# EAGLE board axiom_beta_power_board_v0.20 (EAGLE 7.0.0), part 1 of 3
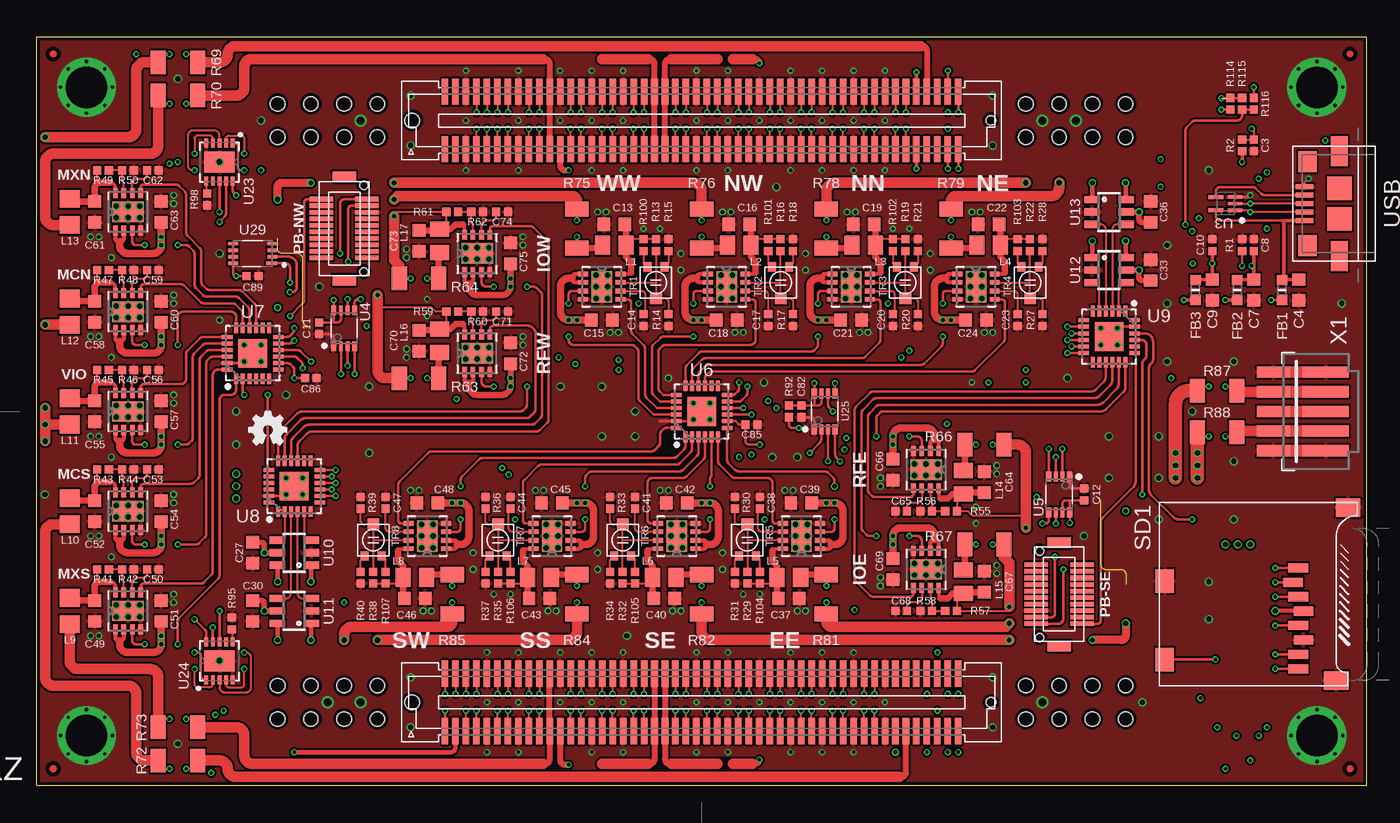
[diagram p10: board, top side]
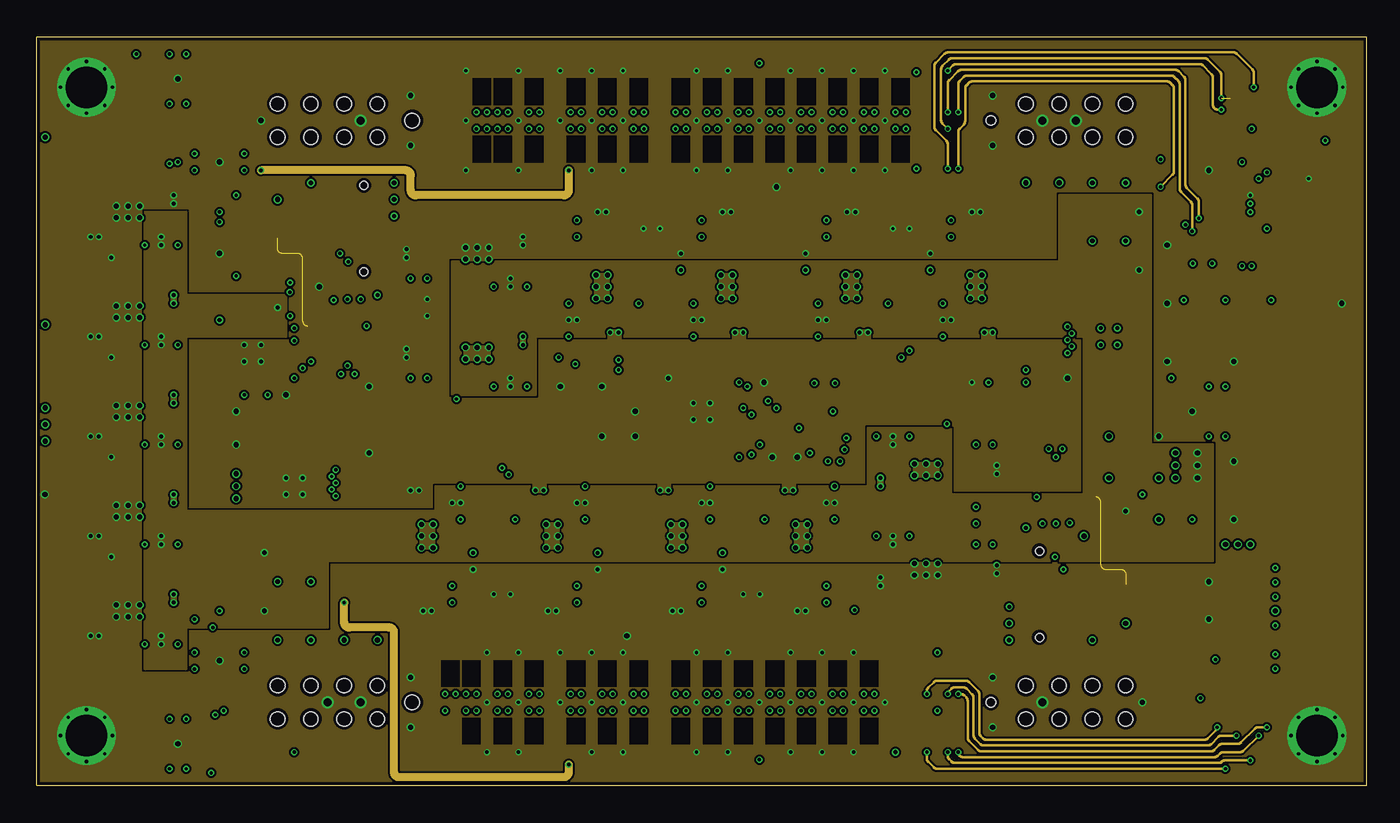
[diagram p11: board, inner layer Route2]
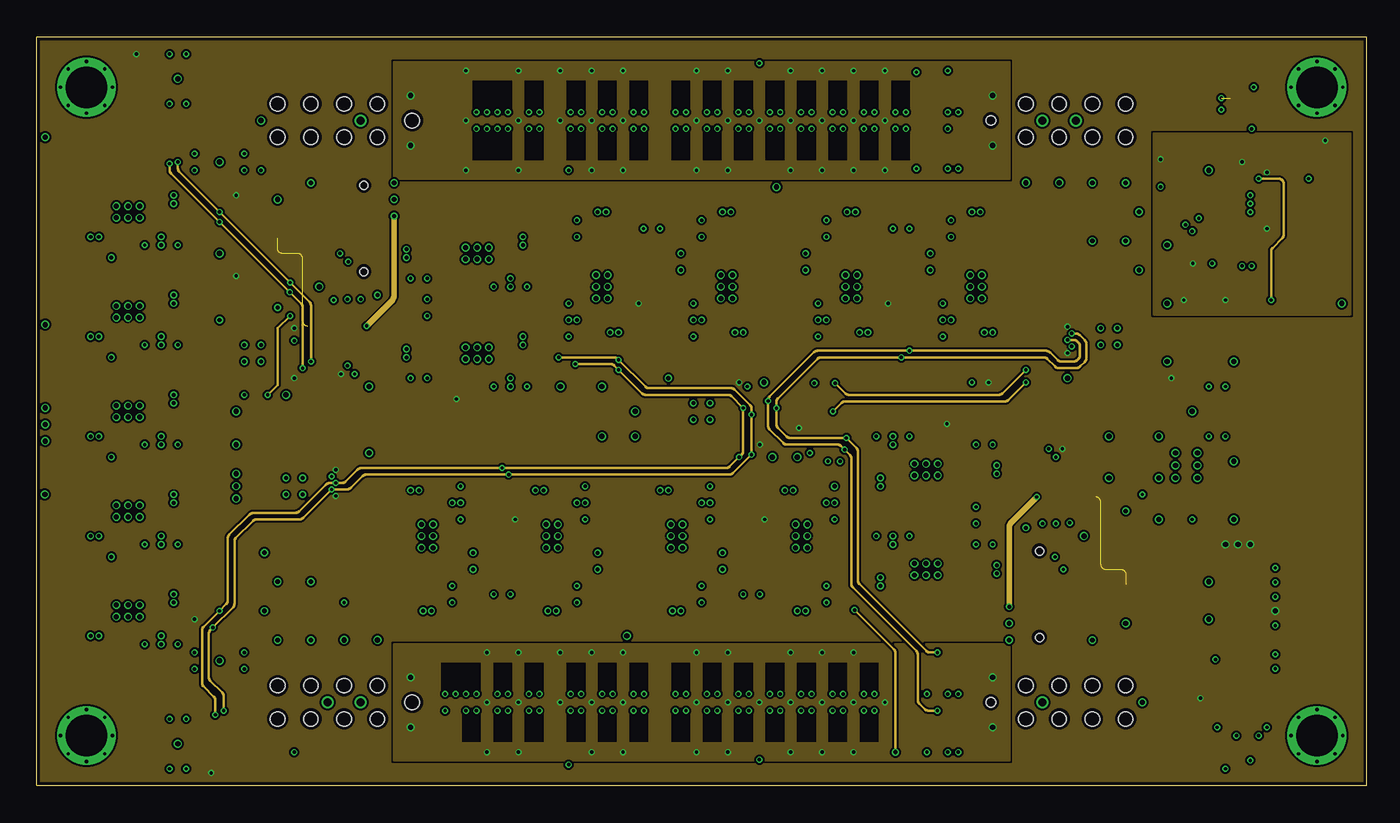
[diagram p12: board, inner layer Route15]
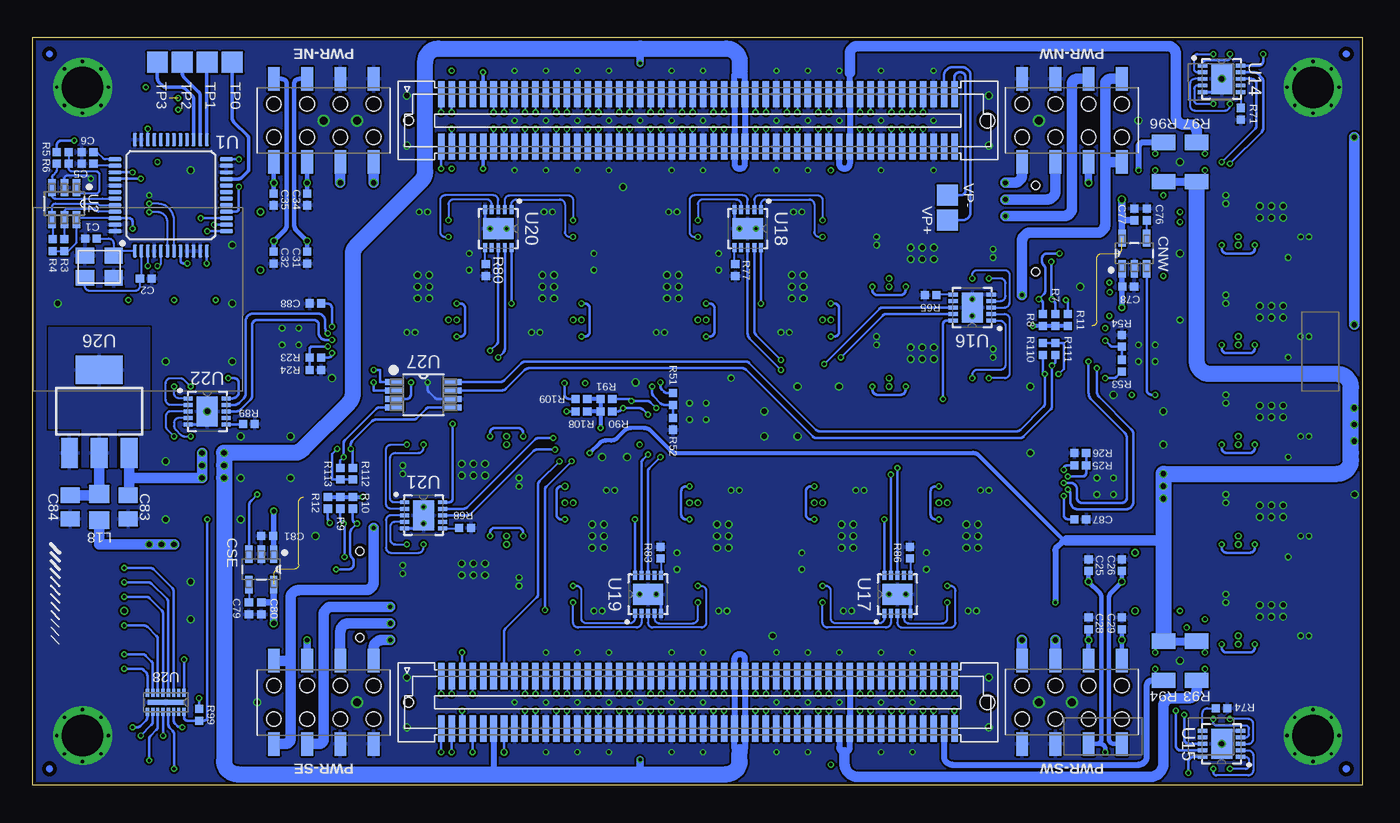
[diagram p13: board, bottom side, seen from below]

Size 101.6 x 57.15 mm. Coordinates in mm from the lower left corner, seen from the top.
Outline: 101.6,57.15 0,57.15 0,0 101.6,0 101.6,57.15
Copper layers (1*2*15*16): Top 0.035559375mm / dielectric 0.17018125mm / Route2 0.01778125mm / dielectric 47mil / Route15 0.01778125mm / dielectric 0.17018125mm / Bottom 0.035559375mm
Design rules "OSHPark-4layer-tuned *": minimum track width 5mil, minimum drill 10mil, track to track 6mil, track to pad 5mil, pad to pad 5mil, via to via 5mil, smd to smd 0mil, copper to edge 10mil, drill to drill 6mil, minimum pad ring 4mil, minimum via ring 4mil, stop-mask expansion 2mil, vias tented up to drill 25mil, thermal gap 6mil
Net classes: 1 LVDS: width 0.152 mm, drill 0.254 mm, clearance 0.152 mm
tKeepout: area 1.3,50.8 to 6.3,55.9; area 1.3,1.3 to 6.3,6.3; area 95.2,1.3 to 100.3,6.3; area 95.2,50.8 to 100.3,55.9
bKeepout: area 95.2,50.8 to 100.3,55.9; area 95.2,1.3 to 100.3,6.3; area 1.3,1.3 to 6.3,6.3; area 1.3,50.8 to 6.3,55.9
tRestrict: area 99.8,55.3 to 100.9,56.4; area 99.8,0.7 to 100.9,1.8; area 0.7,55.3 to 1.8,56.4; area 0.7,0.7 to 1.8,1.8
bRestrict: area 99.8,55.3 to 100.9,56.4; area 99.8,0.7 to 100.9,1.8; area 0.7,55.3 to 1.8,56.4; area 0.7,0.7 to 1.8,1.8

## Footprints (pad centres in the part's own frame; a part is rotated, then mirrored left to right if it is on the bottom)
µZ-SOCKET-NOHOLES-R = smd 0.5 x 2: 1 19.6,24.425; 2 19.6,20.027; 3 18.8,24.425; 4 18.8,20.027; 5 18,24.425; 6 18,20.027; 7 17.2,24.425; 8 17.2,20.027; 9 16.4,24.425; 10 16.4,20.027; 11 15.6,24.425; 12 15.6,20.027; 13 14.8,24.425; 14 14.8,20.027; 15 14,24.425; 16 14,20.027; 17 13.2,24.425; 18 13.2,20.027; 19 12.4,24.425; 20 12.4,20.027; 21 11.6,24.425; 22 11.6,20.027; 23 10.8,24.425; 24 10.8,20.027; 25 10,24.425; 26 10,20.027; 27 9.2,24.425; 28 9.2,20.027; 29 8.4,24.425; 30 8.4,20.027; 31 7.6,24.425; 32 7.6,20.027; 33 6.8,24.425; 34 6.8,20.027; 35 6,24.425; 36 6,20.027; 37 5.2,24.425; 38 5.2,20.027; 39 4.4,24.425; 40 4.4,20.027; 41 3.6,24.425; 42 3.6,20.027; 43 2.8,24.425; 44 2.8,20.027; 45 2,24.425; 46 2,20.027; 47 1.2,24.425; 48 1.2,20.027; 49 0.4,24.425; 50 0.4,20.027; 51 -0.4,24.425; 52 -0.4,20.027; 53 -1.2,24.425; 54 -1.2,20.027; 55 -2,24.425; 56 -2,20.027; 57 -2.8,24.425; 58 -2.8,20.027; 59 -3.6,24.425; 60 -3.6,20.027; 61 -4.4,24.425; 62 -4.4,20.027; 63 -5.2,24.425; 64 -5.2,20.027; 65 -6,24.425; 66 -6,20.027; 67 -6.8,24.425; 68 -6.8,20.027; 69 -7.6,24.425; 70 -7.6,20.027; 71 -8.4,24.425; 72 -8.4,20.027; 73 -9.2,24.425; 74 -9.2,20.027; 75 -10,24.425; 76 -10,20.027; 77 -10.8,24.425; 78 -10.8,20.027; 79 -11.6,24.425; 80 -11.6,20.027; 81 -12.4,24.425; 82 -12.4,20.027; 83 -13.2,24.425; 84 -13.2,20.027; 85 -14,24.425; 86 -14,20.027; 87 -14.8,24.425; 88 -14.8,20.027; 89 -15.6,24.425; 90 -15.6,20.027; 91 -16.4,24.425; 92 -16.4,20.027; 93 -17.2,24.425; 94 -17.2,20.027; 95 -18,24.425; 96 -18,20.027; 97 -18.8,24.425; 98 -18.8,20.027; 99 -19.6,24.425; 100 -19.6,20.027; 101 19.6,-20.025; 102 19.6,-24.425; 103 18.8,-20.027; 104 18.8,-24.425; 105 18,-20.027; 106 18,-24.425; 107 17.2,-20.027; 108 17.2,-24.425; 109 16.4,-20.027; 110 16.4,-24.425; 111 15.6,-20.027; 112 15.6,-24.425; 113 14.8,-20.027; 114 14.8,-24.425; 115 14,-20.027; 116 14,-24.425; 117 13.2,-20.027; 118 13.2,-24.425; 119 12.4,-20.027; 120 12.4,-24.425; 121 11.6,-20.027; 122 11.6,-24.425; 123 10.8,-20.027; 124 10.8,-24.425; 125 10,-20.027; 126 10,-24.425; 127 9.2,-20.027; 128 9.2,-24.425; 129 8.4,-20.027; 130 8.4,-24.425; 131 7.6,-20.027; 132 7.6,-24.425; 133 6.8,-20.027; 134 6.8,-24.425; 135 6,-20.027; 136 6,-24.425; 137 5.2,-20.027; 138 5.2,-24.425; 139 4.4,-20.027; 140 4.4,-24.425; 141 3.6,-20.027; 142 3.6,-24.425; 143 2.8,-20.027; 144 2.8,-24.425; 145 2,-20.027; 146 2,-24.425; 147 1.2,-20.027; 148 1.2,-24.425; 149 0.4,-20.027; 150 0.4,-24.425; 151 -0.4,-20.027; 152 -0.4,-24.425; 153 -1.2,-20.027; 154 -1.2,-24.425; 155 -2,-20.027; 156 -2,-24.425; 157 -2.8,-20.027; 158 -2.8,-24.425; 159 -3.6,-20.027; 160 -3.6,-24.425; 161 -4.4,-20.027; 162 -4.4,-24.425; 163 -5.2,-20.027; 164 -5.2,-24.425; 165 -6,-20.027; 166 -6,-24.425; 167 -6.8,-20.027; 168 -6.8,-24.425; 169 -7.6,-20.027; 170 -7.6,-24.425; 171 -8.4,-20.027; 172 -8.4,-24.425; 173 -9.2,-20.027; 174 -9.2,-24.425; 175 -10,-20.027; 176 -10,-24.425; 177 -10.8,-20.027; 178 -10.8,-24.425; 179 -11.6,-20.027; 180 -11.6,-24.425; 181 -12.4,-20.027; 182 -12.4,-24.425; 183 -13.2,-20.027; 184 -13.2,-24.425; 185 -14,-20.027; 186 -14,-24.425; 187 -14.8,-20.027; 188 -14.8,-24.425; 189 -15.6,-20.027; 190 -15.6,-24.425; 191 -16.4,-20.027; 192 -16.4,-24.425; 193 -17.2,-20.027; 194 -17.2,-24.425; 195 -18,-20.027; 196 -18,-24.425; 197 -18.8,-20.027; 198 -18.8,-24.425; 199 -19.6,-20.027; 200 -19.6,-24.425 | hole 0.725: 22.1,22.225; 22.1,-22.225 | hole 1.125: -22.1,22.225; -22.1,-22.225
0402-B = smd 0.62 x 0.62: 1 -0.45,0; 2 0.45,0
0603-B = smd 0.95 x 1: 1 -0.8,0; 2 0.8,0
0805-B = smd 1.15 x 1.45: 1 -0.9,0; 2 0.9,0
SOT95P280X145-5N = smd 1.321 x 0.559: 1 -1.168,0.94; 2 -1.168,0; 3 -1.168,-0.94; 4 1.168,-0.94; 5 1.168,0.94
DFN65P300X300X100-9N = smd 0.762 x 0.356: 1 -1.422,0.965; 2 -1.422,0.33; 3 -1.422,-0.33; 4 -1.422,-0.965; 5 1.422,-0.965; 6 1.422,-0.33; 7 1.422,0.33; 8 1.422,0.965 | smd 1.549 x 2.413: 9 0,0
_0603MP = smd 0.8 x 0.8: 1 -0.762,0; 2 0.762,0
0805-A = smd 1.35 x 1.55: 1 -1,0; 2 1,0
DF12(XX)-20DP-0.5V = smd 1.8 x 0.35: 1 -1.75,2.25; 2 1.75,2.25; 3 -1.75,1.75; 4 1.75,1.75; 5 -1.75,1.25; 6 1.75,1.25; 7 -1.75,0.75; 8 1.75,0.75; 9 -1.75,0.25; 10 1.75,0.25; 11 -1.75,-0.25; 12 1.75,-0.25; 13 -1.75,-0.75; 14 1.75,-0.75; 15 -1.75,-1.25; 16 1.75,-1.25; 17 -1.75,-1.75; 18 1.75,-1.75; 19 -1.75,-2.25; 20 1.75,-2.25 | smd 1.8 x 0.8: M1 0,3.95; M2 0,-3.95 | hole 0.625: 1.5,-3.3; 1.5,3.3
R2X04 = smd 0.9 x 1.8: 1 -3.81,3.175; 2 -3.81,-3.175; 3 -1.27,3.175; 4 -1.27,-3.175; 5 1.27,3.175; 6 1.27,-3.175; 7 3.81,3.175; 8 3.81,-3.175 | hole 1.1: -3.81,1.27; -1.27,1.27; -1.27,-1.27; -3.81,-1.27; 1.27,1.27; 1.27,-1.27; 3.81,1.27; 3.81,-1.27
ABM8G = smd 1.4 x 1.2: 1 -1.1,-0.85; 2 1.1,-0.85; 3 1.1,0.85; 4 -1.1,0.85
1206-B = smd 1.15 x 1.8: 1 -1.5,0; 2 1.5,0
TF-MICRO-SD_PP2 = smd 0.7 x 1.5: 1 9,-10.64; 2 7.9,-10.24; 3 6.8,-10.64; 4 5.7,-11.04; 5 4.6,-10.64; 6 3.5,-11.04; 7 2.4,-10.64; 8 1.3,-10.64 | smd 1.8 x 1.4: CD1 2,-0.44; CD2 8,-0.44 | smd 1.4 x 1.9: MT1 0.4,-13.54; MT2 13.6,-14.44
TP16SQ = smd 1.6 x 1.6: TP 0,0
TRIM-PVZ2A = smd 0.6 x 0.7: 1 -0.65,-1.2; 3 0.65,-1.2 | smd 0.9 x 0.9: 2 0,1.2
LQFP48 = smd 0.3 x 1: 1 -2.75,-4.25; 2 -2.25,-4.25; 3 -1.75,-4.25; 4 -1.25,-4.25; 5 -0.75,-4.25; 6 -0.25,-4.25; 7 0.25,-4.25; 8 0.75,-4.25; 9 1.25,-4.25; 10 1.75,-4.25; 11 2.25,-4.25; 12 2.75,-4.25; 25 2.75,4.25; 26 2.25,4.25; 27 1.75,4.25; 28 1.25,4.25; 29 0.75,4.25; 30 0.25,4.25; 31 -0.25,4.25; 32 -0.75,4.25; 33 -1.25,4.25; 34 -1.75,4.25; 35 -2.25,4.25; 36 -2.75,4.25 | smd 1 x 0.3: 13 4.25,-2.75; 14 4.25,-2.25; 15 4.25,-1.75; 16 4.25,-1.25; 17 4.25,-0.75; 18 4.25,-0.25; 19 4.25,0.25; 20 4.25,0.75; 21 4.25,1.25; 22 4.25,1.75; 23 4.25,2.25; 24 4.25,2.75; 37 -4.25,2.75; 38 -4.25,2.25; 39 -4.25,1.75; 40 -4.25,1.25; 41 -4.25,0.75; 42 -4.25,0.25; 43 -4.25,-0.25; 44 -4.25,-0.75; 45 -4.25,-1.25; 46 -4.25,-1.75; 47 -4.25,-2.25; 48 -4.25,-2.75
SOT95P280X145-6N = smd 1.27 x 0.559: 1 -1.219,0.94; 2 -1.219,0; 3 -1.219,-0.94; 4 1.219,-0.94; 5 1.219,0; 6 1.219,0.94
SOT50P160X60-5N = smd 1.118 x 0.254: 1 -0.737,0.508; 2 -0.737,0; 3 -0.737,-0.508 | smd 1.118 x 0.305: 4 0.737,-0.508; 5 0.737,0.508
VSSOP-8 = smd 0.75 x 0.4: 1 -1.375,0.8; 4 -1.375,-0.8; 5 1.375,-0.8; 8 1.375,0.8 | smd 0.75 x 0.3: 2 -1.375,0.25; 3 -1.375,-0.25; 6 1.375,-0.25; 7 1.375,0.25
QFN50P400X400X80-25N = smd 0.813 x 0.305: 1 -1.95,1.25; 2 -1.95,0.75; 3 -1.95,0.25; 4 -1.95,-0.25; 5 -1.95,-0.75; 6 -1.95,-1.25; 13 1.95,-1.25; 14 1.95,-0.75; 15 1.95,-0.25; 16 1.95,0.25; 17 1.95,0.75; 18 1.95,1.25 | smd 0.305 x 0.813: 7 -1.25,-1.95; 8 -0.75,-1.95; 9 -0.25,-1.95; 10 0.25,-1.95; 11 0.75,-1.95; 12 1.25,-1.95; 19 1.25,1.95; 20 0.75,1.95; 21 0.25,1.95; 22 -0.25,1.95; 23 -0.75,1.95; 24 -1.25,1.95 | smd 2.2 x 2.2: 25 0,0
SOT23-6 = smd 0.55 x 1.2: 1 -0.95,-1.3; 2 0,-1.3; 3 0.95,-1.3; 4 0.95,1.3; 5 0,1.3; 6 -0.95,1.3
DFN3X3_10LEAD = smd 0.7 x 0.3: 1 -1.45,1; 2 -1.45,0.5; 3 -1.45,0; 4 -1.45,-0.5; 5 -1.45,-1; 6 1.45,-1; 7 1.45,-0.5; 8 1.45,0; 9 1.45,0.5; 10 1.45,1 | smd 1.6 x 2.3: EPAD 0,0
SOT-223 = smd 1.27 x 2.286: 1 -2.286,-3.175; 2 0,-3.175; 3 2.286,-3.175 | smd 3.556 x 2.159: TER 0,3.175
SOP65P490X110-8N = smd 1.422 x 0.457: 1 -2.21,0.965; 2 -2.21,0.33; 3 -2.21,-0.33; 4 -2.21,-0.965; 5 2.21,-0.965; 6 2.21,-0.33; 7 2.21,0.33; 8 2.21,0.965
SON40P135X330X55-17N = smd 0.61 x 0.254: 1 -0.737,1.397; 2 -0.737,0.991; 3 -0.737,0.61; 4 -0.737,0.203; 5 -0.737,-0.203; 6 -0.737,-0.61; 7 -0.737,-0.991; 8 -0.737,-1.397; 9 0.737,-1.397; 10 0.737,-0.991; 11 0.737,-0.61; 12 0.737,-0.203; 13 0.737,0.203; 14 0.737,0.61; 15 0.737,0.991; 16 0.737,1.397 | smd 0.406 x 2.794: 17 0,0
SOT996-2/3 = smd 0.25 x 0.85: 1 -0.75,-1.45 | smd 0.25 x 0.75: 2 -0.25,-1.5; 3 0.25,-1.5; 4 0.75,-1.5; 5 0.75,1.5; 6 0.25,1.5; 7 -0.25,1.5; 8 -0.75,1.5
MICRO-AB-H-SMT = smd 0.4 x 1.35: 1 -1.3,4.125; 2 -0.65,4.125; 3 0,4.125; 4 0.65,4.125; 5 1.3,4.125 | smd 2.3 x 1.3: Z1 -4,1.45; Z4 4,1.45 | smd 1.8 x 1.9: Z2 -1.15,1.45; Z3 1.15,1.45 | smd 1.6 x 1.4: Z5 -3.2,3.9; Z6 3.2,3.9
PICO-SPOX-5 = smd 0.85 x 2.55: 1 -3,-6.5; 2 -1.5,-6.5; 3 0,-6.5; 4 1.5,-6.5; 5 3,-6.5 | smd 0.85 x 3.55: 1A -3,-2.5; 2A -1.5,-2.5; 3A 0,-2.5; 4A 1.5,-2.5; 5A 3,-2.5
µZ-CONONLY = smd 0.5 x 2: 1 19.6,-24.226; 2 19.6,-20.226; 3 18.8,-24.226; 4 18.8,-20.226; 5 18,-24.226; 6 18,-20.226; 7 17.2,-24.226; 8 17.2,-20.226; 9 16.4,-24.226; 10 16.4,-20.226; 11 15.6,-24.226; 12 15.6,-20.226; 13 14.8,-24.226; 14 14.8,-20.226; 15 14,-24.226; 16 14,-20.226; 17 13.2,-24.226; 18 13.2,-20.226; 19 12.4,-24.226; 20 12.4,-20.226; 21 11.6,-24.226; 22 11.6,-20.226; 23 10.8,-24.226; 24 10.8,-20.226; 25 10,-24.226; 26 10,-20.226; 27 9.2,-24.226; 28 9.2,-20.226; 29 8.4,-24.226; 30 8.4,-20.226; 31 7.6,-24.226; 32 7.6,-20.226; 33 6.8,-24.226; 34 6.8,-20.226; 35 6,-24.226; 36 6,-20.226; 37 5.2,-24.226; 38 5.2,-20.226; 39 4.4,-24.226; 40 4.4,-20.226; 41 3.6,-24.226; 42 3.6,-20.226; 43 2.8,-24.226; 44 2.8,-20.226; 45 2,-24.226; 46 2,-20.226; 47 1.2,-24.226; 48 1.2,-20.226; 49 0.4,-24.226; 50 0.4,-20.226; 51 -0.4,-24.226; 52 -0.4,-20.226; 53 -1.2,-24.226; 54 -1.2,-20.226; 55 -2,-24.226; 56 -2,-20.226; 57 -2.8,-24.226; 58 -2.8,-20.226; 59 -3.6,-24.226; 60 -3.6,-20.226; 61 -4.4,-24.226; 62 -4.4,-20.226; 63 -5.2,-24.226; 64 -5.2,-20.226; 65 -6,-24.226; 66 -6,-20.226; 67 -6.8,-24.226; 68 -6.8,-20.226; 69 -7.6,-24.226; 70 -7.6,-20.226; 71 -8.4,-24.226; 72 -8.4,-20.226; 73 -9.2,-24.226; 74 -9.2,-20.226; 75 -10,-24.226; 76 -10,-20.226; 77 -10.8,-24.226; 78 -10.8,-20.226; 79 -11.6,-24.226; 80 -11.6,-20.226; 81 -12.4,-24.226; 82 -12.4,-20.226; 83 -13.2,-24.226; 84 -13.2,-20.226; 85 -14,-24.226; 86 -14,-20.226; 87 -14.8,-24.226; 88 -14.8,-20.226; 89 -15.6,-24.226; 90 -15.6,-20.226; 91 -16.4,-24.226; 92 -16.4,-20.226; 93 -17.2,-24.226; 94 -17.2,-20.226; 95 -18,-24.226; 96 -18,-20.226; 97 -18.8,-24.226; 98 -18.8,-20.226; 99 -19.6,-24.226; 100 -19.6,-20.226; 101 19.6,20.226; 102 19.6,24.226; 103 18.8,20.226; 104 18.8,24.226; 105 18,20.226; 106 18,24.226; 107 17.2,20.226; 108 17.2,24.226; 109 16.4,20.226; 110 16.4,24.226; 111 15.6,20.226; 112 15.6,24.226; 113 14.8,20.226; 114 14.8,24.226; 115 14,20.226; 116 14,24.226; 117 13.2,20.226; 118 13.2,24.226; 119 12.4,20.226; 120 12.4,24.226; 121 11.6,20.226; 122 11.6,24.226; 123 10.8,20.226; 124 10.8,24.226; 125 10,20.226; 126 10,24.226; 127 9.2,20.226; 128 9.2,24.226; 129 8.4,20.226; 130 8.4,24.226; 131 7.6,20.226; 132 7.6,24.226; 133 6.8,20.226; 134 6.8,24.226; 135 6,20.226; 136 6,24.226; 137 5.2,20.226; 138 5.2,24.226; 139 4.4,20.226; 140 4.4,24.226; 141 3.6,20.226; 142 3.6,24.226; 143 2.8,20.226; 144 2.8,24.226; 145 2,20.226; 146 2,24.226; 147 1.2,20.226; 148 1.2,24.226; 149 0.4,20.226; 150 0.4,24.226; 151 -0.4,20.226; 152 -0.4,24.226; 153 -1.2,20.226; 154 -1.2,24.226; 155 -2,20.226; 156 -2,24.226; 157 -2.8,20.226; 158 -2.8,24.226; 159 -3.6,20.226; 160 -3.6,24.226; 161 -4.4,20.226; 162 -4.4,24.226; 163 -5.2,20.226; 164 -5.2,24.226; 165 -6,20.226; 166 -6,24.226; 167 -6.8,20.226; 168 -6.8,24.226; 169 -7.6,20.226; 170 -7.6,24.226; 171 -8.4,20.226; 172 -8.4,24.226; 173 -9.2,20.226; 174 -9.2,24.226; 175 -10,20.226; 176 -10,24.226; 177 -10.8,20.226; 178 -10.8,24.226; 179 -11.6,20.226; 180 -11.6,24.226; 181 -12.4,20.226; 182 -12.4,24.226; 183 -13.2,20.226; 184 -13.2,24.226; 185 -14,20.226; 186 -14,24.226; 187 -14.8,20.226; 188 -14.8,24.226; 189 -15.6,20.226; 190 -15.6,24.226; 191 -16.4,20.226; 192 -16.4,24.226; 193 -17.2,20.226; 194 -17.2,24.226; 195 -18,20.226; 196 -18,24.226; 197 -18.8,20.226; 198 -18.8,24.226; 199 -19.6,20.226; 200 -19.6,24.226 | hole 1.125: -22.1,-22.225; -22.1,22.225 | hole 0.725: 22.1,-22.225; 22.1,22.225

## Placement (x,y rotation side)
BETA  µZ-FCI-SOCKET-NOHOLES-R  [µZ-SOCKET-NOHOLES-R]  50.8,28.57 0 top
C1  [0402-B]  97.16,41.78 180 bottom
C2  [0402-B]  92.96,38.73 0 bottom
C3  10n  [0402-B]  92.96,48.89 270 top
C4  100n  [0603-B]  96.39,37.85 270 top
C5  100n  [0402-B]  97.41,47.5 180 bottom
C6  100n  [0402-B]  97.41,48.39 180 bottom
C7  4µ7  [0603-B]  92.96,37.85 270 top
C8  100n  [0402-B]  92.96,41.27 90 top
C9  4µ7  [0603-B]  89.79,37.85 270 top
C10  100n  [0402-B]  89.79,41.27 90 top
C11  10n  [0402-B]  21.59,34.92 270 top
C12  10n  [0402-B]  80.01,22.23 90 top
C13  [0603-B]  44.13,42.86 180 top
C14  [0402-B]  46.35,35.56 270 top
C15  [0603-B]  43.18,35.56 0 top
C16  [0603-B]  53.66,42.86 180 top
C17  [0402-B]  55.88,35.56 270 top
C18  [0603-B]  52.7,35.56 0 top
C19  [0603-B]  63.18,42.86 180 top
C20  [0402-B]  65.41,35.56 270 top
C21  [0603-B]  62.23,35.56 0 top
C22  [0603-B]  72.71,42.86 180 top
C23  [0402-B]  74.93,35.56 270 top
C24  [0603-B]  71.75,35.56 0 top
C25  1µ  [0402-B]  20.95,16.83 90 bottom
C26  1µ  [0402-B]  18.41,16.83 90 bottom
C27  4µ7  [0603-B]  16.51,17.78 270 top
C28  1µ  [0402-B]  20.95,12.38 90 bottom
C29  1µ  [0402-B]  18.41,12.38 90 bottom
C30  4µ7  [0603-B]  16.51,13.33 270 top
C31  1µ  [0402-B]  80.64,40.32 270 bottom
C32  1µ  [0402-B]  83.19,40.32 270 bottom
C33  4µ7  [0603-B]  85.09,39.37 90 top
C34  1µ  [0402-B]  80.64,44.77 270 bottom
C35  1µ  [0402-B]  83.19,44.77 270 bottom
C36  4µ7  [0603-B]  85.09,43.81 90 top
C37  [0603-B]  57.47,14.29 0 top
C38  [0402-B]  55.24,21.59 90 top
C39  [0603-B]  58.42,21.59 180 top
C40  [0603-B]  47.94,14.29 0 top
C41  [0402-B]  45.72,21.59 90 top
C42  [0603-B]  48.89,21.59 180 top
C43  [0603-B]  38.42,14.29 0 top
C44  [0402-B]  36.19,21.59 90 top
C45  [0603-B]  39.37,21.59 180 top
C46  [0603-B]  28.89,14.29 0 top
C47  [0402-B]  26.67,21.59 90 top
C48  [0603-B]  29.84,21.59 180 top
C49  [0603-B]  4.45,13.33 270 top
C50  [0402-B]  8.89,16.51 0 top
C51  [0603-B]  9.52,13.33 90 top
C52  [0603-B]  4.45,20.95 270 top
C53  [0402-B]  8.89,24.13 0 top
C54  [0603-B]  9.52,20.95 90 top
C55  [0603-B]  4.45,28.57 270 top
C56  [0402-B]  8.89,31.75 0 top
C57  [0603-B]  9.52,28.57 90 top
C58  [0603-B]  4.45,36.2 270 top
C59  [0402-B]  8.89,39.37 0 top
C60  [0603-B]  9.52,36.2 90 top
C61  [0603-B]  4.45,43.81 270 top
C62  [0402-B]  8.89,46.99 0 top
C63  [0603-B]  9.52,43.81 90 top
C64  [0603-B]  72.39,23.18 90 top
C65  [0402-B]  66.04,20.95 180 top
C66  [0603-B]  65.41,24.13 270 top
C67  [0603-B]  72.39,15.56 90 top
C68  [0402-B]  66.04,13.33 180 top
C69  [0603-B]  65.41,16.51 270 top
C70  10µ  [0603-B]  29.21,33.97 270 top
C71  [0402-B]  35.56,36.2 0 top
C72  10µ  [0603-B]  36.19,33.02 90 top
C73  [0603-B]  29.21,41.59 270 top
C74  [0402-B]  35.56,43.81 0 top
C75  [0603-B]  36.19,40.64 90 top
C76  10n  [0402-B]  16.51,43.62 90 bottom
C77  1µ  [0402-B]  17.46,43.62 90 bottom
C78  1µ  [0402-B]  17.93,38.1 0 bottom
C79  10n  [0402-B]  85.09,13.53 270 bottom
C80  1µ  [0402-B]  84.14,13.53 270 bottom
C81  1µ  [0402-B]  83.69,19.05 180 bottom
C82  10n  [0402-B]  58.42,28.57 270 top
C83  22µ  [0805-B]  94.3,21.27 270 bottom
C84  22µ  [0805-B]  98.74,21.27 270 bottom
C85  100n  [0402-B]  54.61,27.56 0 top
C86  100n  [0402-B]  20.95,31.11 0 top
C87  100n  [0402-B]  21.59,20.32 0 bottom
C88  100n  [0402-B]  80.01,36.83 180 bottom
C89  100n  [0402-B]  16.51,38.93 0 top
CNW  SPX3819M5-L  [SOT95P280X145-5N]  17.46,40.64 90 bottom
CSE  SPX3819M5-L  [SOT95P280X145-5N]  84.14,16.51 270 bottom
EE  MCP1727-ADJE/MF  [DFN65P300X300X100-9N]  58.42,19.05 180 top
FB1  600R  [_0603MP]  95.12,37.85 270 top
FB2  600R  [_0603MP]  91.69,37.85 90 top
FB3  600R  [_0603MP]  88.52,37.85 90 top
IOE  MCP1727-ADJE/MF  [DFN65P300X300X100-9N]  67.94,16.51 270 top
IOW  MCP1727-ADJE/MF  [DFN65P300X300X100-9N]  33.66,40.64 90 top
L1  [0805-B]  44.13,41.27 180 top
L2  [0805-B]  53.66,41.27 180 top
L3  [0805-B]  63.18,41.27 180 top
L4  [0805-B]  72.71,41.27 180 top
L5  [0805-B]  57.47,15.88 0 top
L6  [0805-B]  47.94,15.88 0 top
L7  [0805-B]  38.42,15.88 0 top
L8  [0805-B]  28.89,15.88 0 top
L9  [0805-A]  2.54,13.33 270 top
L10  [0805-A]  2.54,20.95 270 top
L11  [0805-A]  2.54,28.57 270 top
L12  [0805-A]  2.54,36.2 270 top
L13  [0805-A]  2.54,43.81 270 top
L14  [0805-B]  70.8,23.18 90 top
L15  [0805-B]  70.8,15.56 90 top
L16  [0805-B]  30.8,33.97 270 top
L17  [0805-B]  30.8,41.59 270 top
L18  [0805-A]  96.52,21.27 270 bottom
LOGO1  OSHW_LOGO_FILLX0100-NT  [OSHW_FILLX100_NOTEXT]  16.26,26.04 0 top
MCN  MCP1727-ADJE/MF  [DFN65P300X300X100-9N]  6.98,36.2 90 top
MCS  MCP1727-ADJE/MF  [DFN65P300X300X100-9N]  6.98,20.95 90 top
MXN  MCP1727-ADJE/MF  [DFN65P300X300X100-9N]  6.98,43.81 90 top
MXS  MCP1727-ADJE/MF  [DFN65P300X300X100-9N]  6.98,13.33 90 top
NE  MCP1727-ADJE/MF  [DFN65P300X300X100-9N]  71.75,38.1 0 top
NN  MCP1727-ADJE/MF  [DFN65P300X300X100-9N]  62.23,38.1 0 top
NW  MCP1727-ADJE/MF  [DFN65P300X300X100-9N]  52.7,38.1 0 top
PB-NW  DF12(XX)-20DP-0.5V  [DF12(XX)-20DP-0.5V]  23.49,42.55 0 top
PB-SE  DF12(XX)-20DP-0.5V  [DF12(XX)-20DP-0.5V]  78.1,14.6 180 top
PWR-NE  PINRC-2X04  [R2X04]  79.38,50.8 180 bottom
PWR-NW  PINRC-2X04  [R2X04]  22.22,50.8 0 bottom
PWR-SE  PINRC-2X04  [R2X04]  79.38,6.35 180 bottom
PWR-SW  PINRC-2X04  [R2X04]  22.22,6.35 0 bottom
Q1  SMD-4P-2G-3.2X2.5  [ABM8G]  96.52,39.62 180 bottom
R1  12k  [0402-B]  92.07,41.27 270 top
R2  10k  [0402-B]  92.07,48.89 270 top
R3  10k  [0402-B]  99.19,41.27 270 bottom
R4  10k  [0402-B]  100.08,41.27 270 bottom
R5  10k  [0402-B]  99.31,48.39 180 bottom
R6  2k  [0402-B]  99.31,47.5 180 bottom
R7  4k7  [0402-B]  23.49,35.56 90 bottom
R8  4k7  [0402-B]  24.45,35.56 90 bottom
R9  4k7  [0402-B]  78.1,21.59 270 bottom
R10  4k7  [0402-B]  77.15,21.59 270 bottom
R11  200k  [0402-B]  22.54,35.56 90 bottom
R12  200k  [0402-B]  79.06,21.59 270 bottom
R13  [0402-B]  47.31,41.27 270 top
R14  [0402-B]  48.26,35.56 270 top
R15  [0402-B]  48.26,41.27 90 top
R16  [0402-B]  56.83,41.27 270 top
R17  [0402-B]  57.78,35.56 270 top
R18  [0402-B]  57.78,41.27 90 top
R19  [0402-B]  66.36,41.27 270 top
R20  [0402-B]  67.31,35.56 270 top
R21  [0402-B]  67.31,41.27 90 top
R22  [0402-B]  75.88,41.27 270 top
R23  22k  [0402-B]  80.01,32.7 180 bottom
R24  10k  [0402-B]  80.01,31.75 0 bottom
R25  13k  [0402-B]  21.59,24.45 0 bottom
R26  10k  [0402-B]  21.59,25.4 180 bottom
R27  [0402-B]  76.83,35.56 270 top
R28  [0402-B]  76.83,41.27 90 top
R29  [0402-B]  54.29,15.88 90 top
R30  [0402-B]  53.34,21.59 90 top
R31  [0402-B]  53.34,15.88 270 top
R32  [0402-B]  44.77,15.88 90 top
R33  [0402-B]  43.81,21.59 90 top
R34  [0402-B]  43.81,15.88 270 top
R35  [0402-B]  35.24,15.88 90 top
R36  [0402-B]  34.29,21.59 90 top
R37  [0402-B]  34.29,15.88 270 top
R38  [0402-B]  25.72,15.88 90 top
R39  [0402-B]  24.76,21.59 90 top
R40  [0402-B]  24.76,15.88 270 top
R41  [0402-B]  5.08,16.51 0 top
R42  [0402-B]  6.98,16.51 0 top
R43  [0402-B]  5.08,24.13 0 top
R44  [0402-B]  6.98,24.13 0 top
R45  [0402-B]  5.08,31.75 0 top
R46  [0402-B]  6.98,31.75 0 top
R47  [0402-B]  5.08,39.37 0 top
R48  [0402-B]  6.98,39.37 0 top
R49  [0402-B]  5.08,46.99 0 top
R50  [0402-B]  6.98,46.99 0 top
R51  13k  [0402-B]  52.7,29.53 270 bottom
R52  3k  [0402-B]  52.7,27.62 270 bottom
R53  15k  [0402-B]  18.41,32.07 90 bottom
R54  1k  [0402-B]  18.41,33.97 90 bottom
R55  [0402-B]  69.85,20.95 180 top
R56  [0402-B]  67.94,20.95 180 top
R57  [0402-B]  69.85,13.33 180 top
R58  [0402-B]  67.94,13.33 180 top
R59  [0402-B]  31.75,36.2 0 top
R60  [0402-B]  33.66,36.2 0 top
R61  [0402-B]  31.75,43.81 0 top
R62  [0402-B]  33.66,43.81 0 top
R63  [1206-B]  29.21,31.11 180 top
R64  [1206-B]  29.21,38.73 180 top
R65  5k6  [0402-B]  33.02,37.47 180 bottom
R66  [1206-B]  72.39,26.04 0 top
R67  [1206-B]  72.39,18.41 0 top
R68  9k1  [0402-B]  68.58,19.68 0 bottom
R69  [1206-B]  10.79,55.25 0 top
R70  [1206-B]  10.79,52.7 0 top
R71  2k0  [0402-B]  9.33,51.31 270 bottom
R72  [1206-B]  10.79,1.9 0 top
R73  [1206-B]  10.79,4.45 0 top
R74  2k7  [0402-B]  10.79,5.91 0 bottom
R75  [1206-B]  41.27,42.55 90 top
R76  [1206-B]  50.8,42.55 90 top
R77  750R  [0402-B]  47.94,39.37 270 bottom
R78  [1206-B]  60.32,42.55 90 top
R79  [1206-B]  69.85,42.55 90 top
R80  1k27  [0402-B]  66.99,39.37 270 bottom
R81  [1206-B]  60.32,14.6 270 top
R82  [1206-B]  50.8,14.6 270 top
R83  0R  [0402-B]  53.66,17.78 90 bottom
R84  [1206-B]  41.27,14.6 270 top
R85  [1206-B]  31.75,14.6 270 top
R86  100R  [0402-B]  34.61,17.78 90 bottom
R87  [1206-B]  90.17,30.16 180 top
R88  [1206-B]  90.17,26.99 180 top
R89  1k6  [0402-B]  85.09,27.62 0 bottom
R90  4k7  [0402-B]  57.78,28.57 0 bottom
R91  4k7  [0402-B]  57.78,29.53 0 bottom
R92  200k  [0402-B]  57.47,28.57 90 top
R93  [1206-B]  12.7,9.52 270 bottom
R94  [1206-B]  15.24,9.52 270 bottom
R95  430R  [0402-B]  14.92,12.38 90 top
R96  [1206-B]  15.24,47.62 90 bottom
R97  [1206-B]  12.7,47.62 90 bottom
R98  560R  [0402-B]  13.02,44.77 270 top
R99  10k  [0402-B]  88.9,5.4 270 bottom
R100  [0402-B]  46.35,41.27 90 top
R101  [0402-B]  55.88,41.27 90 top
R102  [0402-B]  65.41,41.27 90 top
R103  [0402-B]  74.93,41.27 90 top
R104  [0402-B]  55.24,15.88 270 top
R105  [0402-B]  45.72,15.88 270 top
R106  [0402-B]  36.19,15.88 270 top
R107  [0402-B]  26.67,15.88 270 top
R108  4k7  [0402-B]  59.69,28.57 180 bottom
R109  4k7  [0402-B]  59.69,29.53 180 bottom
R110  4k7  [0402-B]  24.45,33.34 270 bottom
R111  4k7  [0402-B]  23.49,33.34 270 bottom
R112  4k7  [0402-B]  77.15,23.81 90 bottom
R113  4k7  [0402-B]  78.1,23.81 90 bottom
R114  0R  [0402-B]  91.19,52.07 90 top
R115  0R  [0402-B]  92.07,52.07 90 top
R116  0R  [0402-B]  92.96,52.07 90 top
RFE  MCP1727-ADJE/MF  [DFN65P300X300X100-9N]  67.94,24.13 270 top
RFW  MCP1727-ADJE/MF  [DFN65P300X300X100-9N]  33.66,33.02 90 top
SD1  MICRO-SD-2CD  [TF-MICRO-SD_PP2]  85.72,7.62 90 top
SE  MCP1727-ADJE/MF  [DFN65P300X300X100-9N]  48.89,19.05 180 top
SS  MCP1727-ADJE/MF  [DFN65P300X300X100-9N]  39.37,19.05 180 top
SW  MCP1727-ADJE/MF  [DFN65P300X300X100-9N]  29.84,19.05 180 top
TP0  TPTP16SQ  [TP16SQ]  86.36,55.25 0 bottom
TP1  TPTP16SQ  [TP16SQ]  88.27,55.25 180 bottom
TP2  TPTP16SQ  [TP16SQ]  90.17,55.25 0 bottom
TP3  TPTP16SQ  [TP16SQ]  92.07,55.25 0 bottom
TR1  PVZ2A  [TRIM-PVZ2A]  47.31,38.42 180 top
TR2  PVZ2A  [TRIM-PVZ2A]  56.83,38.42 180 top
TR3  PVZ2A  [TRIM-PVZ2A]  66.36,38.42 180 top
TR4  PVZ2A  [TRIM-PVZ2A]  75.88,38.42 180 top
TR5  PVZ2A  [TRIM-PVZ2A]  54.29,18.73 0 top
TR6  PVZ2A  [TRIM-PVZ2A]  44.77,18.73 0 top
TR7  PVZ2A  [TRIM-PVZ2A]  35.24,18.73 0 top
TR8  PVZ2A  [TRIM-PVZ2A]  25.72,18.73 0 top
U1  FT232H  [LQFP48]  91.06,45.09 0 bottom
U2  93LC46BT-I/OT  [SOT95P280X145-6N]  99.19,44.45 270 bottom
U3  TPD3E001DRLR  [SOT50P160X60-5N]  90.81,44.45 180 top
U4  GTL2002DC  [VSSOP-8]  23.49,34.92 90 top
U5  GTL2002DC  [VSSOP-8]  78.1,22.23 270 top
U6  [QFN50P400X400X80-25N]  50.8,28.57 90 top
U7  [QFN50P400X400X80-25N]  16.51,33.02 90 top
U8  [QFN50P400X400X80-25N]  19.68,22.86 90 top
U9  [QFN50P400X400X80-25N]  81.91,34.29 270 top
U10  [SOT23-6]  19.68,17.78 90 top
U11  [SOT23-6]  19.68,13.33 90 top
U12  [SOT23-6]  81.91,39.37 270 top
U13  [SOT23-6]  81.91,43.81 270 top
U14  PAC1720  [DFN3X3_10LEAD]  10.79,53.97 0 bottom
U15  PAC1720  [DFN3X3_10LEAD]  10.79,3.18 180 bottom
U16  PAC1720  [DFN3X3_10LEAD]  29.84,36.51 180 bottom
U17  PAC1720  [DFN3X3_10LEAD]  35.56,14.6 90 bottom
U18  PAC1720  [DFN3X3_10LEAD]  46.99,42.55 270 bottom
U19  PAC1720  [DFN3X3_10LEAD]  54.61,14.6 90 bottom
U20  PAC1720  [DFN3X3_10LEAD]  66.04,42.55 270 bottom
U21  PAC1720  [DFN3X3_10LEAD]  71.75,20.64 0 bottom
U22  PAC1720  [DFN3X3_10LEAD]  88.27,28.57 0 bottom
U23  PAC1720  [DFN3X3_10LEAD]  13.97,47.62 270 top
U24  PAC1720  [DFN3X3_10LEAD]  13.97,9.52 90 top
U25  GTL2002DC  [VSSOP-8]  60.2,28.57 90 top
U26  LD1117S  [SOT-223]  96.52,28.57 0 bottom
U27  PCA9540BDP  [SOP65P490X110-8N]  71.75,29.84 0 bottom
U28  IP4251CZ16-8-TTL  [SON40P135X330X55-17N]  91.44,6.35 270 bottom
U29  LM75BGD  [SOT996-2/3]  16.51,40.64 90 top
USB  5_USB_3S  [MICRO-AB-H-SMT]  100.97,44.45 90 top
VIO  MCP1727-ADJE/MF  [DFN65P300X300X100-9N]  6.98,28.57 90 top
VP+  TPTP16SQ  [TP16SQ]  31.75,43.18 180 bottom
VP-  TPTP16SQ  [TP16SQ]  31.75,45.09 180 bottom
WW  MCP1727-ADJE/MF  [DFN65P300X300X100-9N]  43.18,38.1 0 top
X1  PICO-SPOX-5  [PICO-SPOX-5]  100.97,28.57 270 top
ZED  µZ-FCI-CONONLY  [µZ-CONONLY]  50.8,28.57 180 bottom

## Tracks (layer width: path | path; a pad name or v marks a point on that pad's centre or on a via)
A_!SS  (via drill 0.25)
  Top 0.203: PB-NW.1 20.7,44.8 arc90 20.45,44.54 20.45,37.11 arc-45 20.33,36.84 v19.37,35.88 | v17.65,29.84 17.65,24.11 U8.19
  Route15 0.203: v19.37,35.88 18.41,34.92 18.41,30.61 v17.65,29.84
A_SCL  (via drill 0.25 pad 0.25)
  Top 0.203: PB-NW.2 23.56,44.8 arc90 23.18,44.41 v23.18,40.64 | v24.76,37.15 24.55,37.15 arc90 24.29,36.89 U4.5
  Bottom 0.203: R8.2 24.45,36.83 arc-90 v24.76,37.15 24.37,37.54 arc-45 24.26,37.81 24.26,39.47 arc-45 24.37,39.74 24.4,39.77 arc45 24.51,40.04 24.51,40.26 arc90 24.13,40.64 v23.18,40.64
A_SCL'  (via drill 0.25 pad 0.25)
  Top 0.203: v24.29,31.43 U4.4
  Bottom 0.203: U27.8 65.92,30.81 arc-45 65.56,30.96 64.28,32.24 arc45 63.92,32.38 47.15,32.38 arc45 46.88,32.27 41.77,27.16 arc-45 41.5,27.05 26.45,27.05 arc-45 26.18,27.16 24.41,28.93 arc-45 24.29,29.2 v24.29,31.43 24.45,31.59 R110.2
A_SDA  (via drill 0.25, 0.25 pad 0.25)
  Top 0.203: PB-NW.4 24.07,44.3 arc90 23.81,44.04 v23.81,40 | v23.74,37.15 U4.6
  Bottom 0.203: 23.49,36.13 R7.2 23.49,36.74 arc-45 23.61,37.01 v23.74,37.15 arc45 23.81,37.31 v23.81,40
A_SDA'  (via drill 0.25 pad 0.25)
  Top 0.203: v23.74,32.07 U4.3
  Bottom 0.203: U27.7 65.79,30.18 arc-45 65.43,30.32 64.03,31.73 arc45 63.67,31.88 47.4,31.88 arc45 47.13,31.77 42.02,26.66 arc-45 41.75,26.54 26.19,26.54 arc-45 25.92,26.66 23.86,28.72 arc-45 23.74,28.99 v23.74,32.07 23.49,32.32 R111.2
AB_SCL  (via drill 0.25 pad 0.25)
  Top 0.203: U25.4 61,25.3 arc45 61.11,25.03 v61.38,24.77
  Bottom 0.203: ZED.113 65.6,11.71 arc45 65.49,11.98 63.1,14.37 arc-45 62.99,14.64 62.99,22.99 arc45 62.88,23.26 v61.38,24.77
AB_SCL'  (via drill 0.25)
  Top 0.203: U25.5 v61,30.73
  Route15 0.203: v75.56,31.75 73.77,29.96 arc-45 73.5,29.84 62.04,29.84 arc-45 61.77,29.96 v61,30.73
  Bottom 0.203: R109.2 60.62,29.53 arc90 61,29.91 v61,30.73 | U27.1 75.06,30.81 75.06,31.75 v75.56,31.75
AB_SDA  (via drill 0.25, 0.25 pad 0.25, 0.33 pad 0.25)
  Top 0.203: U25.3 v60.45,24.77
  Route15 0.203: v65.6,2.54 65.6,10.12 arc45 65.49,10.39 v62.48,13.4
  Bottom 0.203: ZED.114 v65.6,2.54 | v62.48,13.4 62.48,22.57 arc45 62.37,22.84 v60.45,24.77
AB_SDA'  (via drill 0.25)
  Top 0.203: U25.6 60.45,29.12 arc45 60.56,28.85 v60.83,28.57
  Route15 0.203: v75.56,30.8 74.22,29.45 arc-45 73.95,29.34 61.75,29.34 arc45 61.48,29.22 v60.83,28.57
  Bottom 0.203: R108.2 v60.83,28.57 | U27.2 75.58,30.18 v75.56,30.8
B_!SS
  Top 0.203: PB-SE.1 81.03,12.36 arc90 81.28,12.61 81.28,20.06 arc-45 81.47,20.51 83.76,22.8 arc45 83.95,23.25 83.95,33.04 U9.19
B_SCL  (via drill 0.25 pad 0.25)
  Top 0.203: PB-SE.2 78.04,12.36 arc90 78.42,12.74 v78.42,16.51 | v76.83,20 77.05,20 arc90 77.3,20.26 U5.5
  Bottom 0.203: R10.2 77.15,20.32 arc-90 v76.83,20 77.23,19.61 arc-45 77.34,19.34 77.34,17.68 arc-45 77.23,17.41 77.2,17.38 arc45 77.09,17.11 77.09,16.89 arc90 77.47,16.51 v78.42,16.51
B_SCL'  (via drill 0.25 pad 0.25)
  Top 0.203: v77.3,25.72 U5.4
  Bottom 0.203: U27.5 71.29,28.88 arc-45 71.56,28.77 72.28,28.05 arc45 72.55,27.94 75.41,27.94 arc-45 75.68,27.83 77.19,26.31 arc-45 77.3,26.04 v77.3,25.72 77.15,25.56 R112.2
B_SDA  (via drill 0.25, 0.25 pad 0.25)
  Top 0.203: PB-SE.4 77.53,12.85 arc90 77.79,13.11 v77.79,17.46 | v77.85,20 U5.6
  Bottom 0.203: R9.2 78.1,20.41 arc-45 77.99,20.14 v77.85,20 arc45 77.79,19.84 v77.79,17.46
B_SDA'  (via drill 0.25 pad 0.25)
  Top 0.203: v77.85,25.08 U5.3
  Bottom 0.203: U27.4 75.1,28.88 arc-45 75.37,28.77 77.74,26.4 arc-45 77.85,26.13 v77.85,25.08 78.1,24.83 R113.2
BANK13_00_N  (via drill 0.25)
  Top 0.152: BETA.89 v35.2,51.44
  Bottom 0.152: ZED.89 v35.2,51.44
BANK13_00_P  (via drill 0.25)
  Top 0.152: BETA.87 v36,51.44
  Bottom 0.152: ZED.87 v36,51.44
BANK13_01_N  (via drill 0.25)
  Top 0.152: BETA.90 v35.2,50.16
  Bottom 0.152: ZED.90 v35.2,50.16
BANK13_01_P  (via drill 0.25)
  Top 0.152: BETA.88 v36,50.16
  Bottom 0.152: ZED.88 v36,50.16
BANK13_02_N  (via drill 0.25)
  Top 0.152: BETA.93 v33.6,51.44
  Bottom 0.152: ZED.93 v33.6,51.44
BANK13_02_P  (via drill 0.25)
  Top 0.152: BETA.91 v34.4,51.44
  Bottom 0.152: ZED.91 v34.4,51.44
BANK13_03_N  (via drill 0.25)
  Top 0.152: BETA.94 v33.6,50.16
  Bottom 0.152: ZED.94 v33.6,50.16
BANK13_03_P  (via drill 0.25)
  Top 0.152: BETA.92 v34.4,50.16
  Bottom 0.152: ZED.92 v34.4,50.16
BANK13_04_N  (via drill 0.25)
  Top 0.152: BETA.195 v32.8,6.98
  Bottom 0.152: ZED.195 v32.8,6.98
BANK13_04_P  (via drill 0.25)
  Top 0.152: BETA.193 v33.6,6.98
  Bottom 0.152: ZED.193 v33.6,6.98
BANK13_05_N  (via drill 0.25)
  Top 0.152: BETA.196 v32.8,5.71
  Bottom 0.152: ZED.196 v32.8,5.71
BANK13_05_P  (via drill 0.25)
  Top 0.152: BETA.194 v33.6,5.71
  Bottom 0.152: ZED.194 v33.6,5.71
BANK13_06_N  (via drill 0.25)
  Top 0.152: BETA.199 v31.2,6.98
  Bottom 0.152: ZED.199 v31.2,6.98
BANK13_06_P  (via drill 0.25)
  Top 0.152: BETA.197 v32,6.98
  Bottom 0.152: ZED.197 v32,6.98
BANK13_SE_0  (via drill 0.25)
  Top 0.203: BETA.200 v31.2,5.71
  Bottom 0.203: ZED.200 v31.2,5.71
BETA_5V  (via drill 0.25 pad 0.25)
  Top 0.152: 91.67,27.07 91.27,26.67 v90.81,26.67
  Top 0.813: X1.4A X1.4 91.67,27.07 R88.1
  Bottom 0.152: U22.3 91.06,28.57 arc-90 91.44,28.19 91.44,27.46 arc-45 91.33,27.19 v90.81,26.67
BETA_5V'  (via drill 0.25 pad 0.25, 0.3 pad 0.25, 0.33 pad 0.25, 0.36, 0.36 pad 0.25, 0.41 pad 0.25)
  Top 0.152: R88.2 88.99,26.67 v89.53,26.67
  Top 0.305: WW.2 41.15,38.43 arc-90 40.89,38.68 40.89,38.75 40.89,38.81 arc-90 41.15,39.06 WW.1 | EE.2 60.45,18.72 arc-90 60.71,18.47 60.71,18.4 60.71,18.34 arc-90 60.45,18.09 EE.1 | NW.2 50.67,38.43 arc-90 50.42,38.68 50.42,38.75 50.42,38.81 arc-90 50.67,39.06 NW.1 | SE.2 50.93,18.72 arc-90 51.18,18.47 51.18,18.4 51.18,18.34 arc-90 50.93,18.09 SE.1 | NN.2 60.2,38.43 arc-90 59.94,38.68 59.94,38.75 59.94,38.81 arc-90 60.2,39.06 NN.1 | SS.2 41.4,18.72 arc-90 41.66,18.47 41.66,18.4 41.66,18.34 arc-90 41.4,18.09 SS.1 | NE.2 69.72,38.43 arc-90 69.47,38.68 69.47,38.75 69.47,38.81 arc-90 69.72,39.06 NE.1 | SW.2 31.88,18.72 arc-90 32.13,18.47 32.13,18.4 32.13,18.34 arc-90 31.88,18.09 SW.1 | VIO.1 6.02,26.54 arc90 6.27,26.29 6.34,26.29 6.4,26.29 arc90 6.65,26.54 VIO.2 | MXN.1 6.02,41.78 arc90 6.27,41.53 6.34,41.53 6.4,41.53 arc90 6.65,41.78 MXN.2 | RFE.2 68.28,26.16 arc-90 68.53,26.42 68.59,26.42 68.66,26.42 arc-90 68.91,26.16 RFE.1 | IOE.1 68.91,18.54 arc90 68.66,18.8 68.59,18.8 68.53,18.8 arc90 68.28,18.54 IOE.2 | IOW.1 32.69,38.61 arc90 32.94,38.35 33.01,38.35 33.07,38.35 arc90 33.32,38.61 IOW.2 | RFW.2 33.32,30.99 arc-90 33.07,30.73 33.01,30.73 32.94,30.73 arc-90 32.69,30.99 RFW.1 | MCN.1 6.02,34.16 arc90 6.27,33.91 6.34,33.91 6.4,33.91 arc90 6.65,34.16 MCN.2 | MCS.1 6.02,18.92 arc90 6.27,18.67 6.34,18.67 6.4,18.67 arc90 6.65,18.92 MCS.2 | MXS.1 6.02,11.3 arc90 6.27,11.05 6.34,11.05 6.4,11.05 arc90 6.65,11.3 MXS.2
  Top 0.406: U12.5 v84.2,39.37 84.2,38.82 arc90 84.45,38.57 C33.1 | U13.5 v84.2,43.81 84.2,43.27 arc90 84.45,43.02 C36.1 | U10.5 v17.4,17.78 17.4,18.33 arc90 17.14,18.58 C27.1 | U11.5 v17.4,13.33 17.4,13.88 arc90 17.14,14.13 C30.1
  Top 0.457: C72.1 v36.19,31.11 v36.19,30.48
  Top 0.508: C75.1 v36.19,38.73 v36.19,38.1 arc-90 35.56,37.47 33.64,37.47 arc-90 33.01,38.1 33.01,38.35 | v36.19,30.48 arc-90 35.56,29.84 33.64,29.84 arc-90 33.01,30.48 33.01,30.73
  Top 0.559: C15.1 v41.27,35.56 v40.64,35.56 arc-90 40,36.2 40,38.11 arc-90 40.64,38.75 40.89,38.75 | C39.1 v60.32,21.59 v60.96,21.59 arc-90 61.59,20.95 61.59,19.04 arc-90 60.96,18.4 60.71,18.4 | C18.1 v50.8,35.56 v50.16,35.56 arc-90 49.53,36.2 49.53,38.11 arc-90 50.16,38.75 50.42,38.75 | C42.1 v50.8,21.59 v51.43,21.59 arc-90 52.07,20.95 52.07,19.04 arc-90 51.43,18.4 51.18,18.4 | C21.1 v60.32,35.56 v59.69,35.56 arc-90 59.05,36.2 59.05,38.11 arc-90 59.69,38.75 59.94,38.75 | C45.1 v41.27,21.59 v41.91,21.59 arc-90 42.54,20.95 42.54,19.04 arc-90 41.91,18.4 41.66,18.4 | C24.1 v69.85,35.56 v69.22,35.56 arc-90 68.58,36.2 68.58,38.11 arc-90 69.22,38.75 69.47,38.75 | C48.1 v31.75,21.59 v32.38,21.59 arc-90 33.02,20.95 33.02,19.04 arc-90 32.38,18.4 32.13,18.4 | C57.1 v9.52,26.67 v9.52,26.04 arc-90 8.89,25.4 6.97,25.4 arc-90 6.34,26.04 6.34,26.29 | C63.1 v9.52,41.91 v9.52,41.27 arc-90 8.89,40.64 6.97,40.64 arc-90 6.34,41.27 6.34,41.53 | C66.1 v65.41,26.04 v65.41,26.67 arc-90 66.04,27.3 67.96,27.3 arc-90 68.59,26.67 68.59,26.42 | C69.1 v65.41,18.41 v65.41,19.05 arc-90 66.04,19.68 67.96,19.68 arc-90 68.59,19.05 68.59,18.8 | C60.1 v9.52,34.29 v9.52,33.66 arc-90 8.89,33.02 6.97,33.02 arc-90 6.34,33.66 6.34,33.91 | C54.1 v9.52,19.05 v9.52,18.41 arc-90 8.89,17.78 6.97,17.78 arc-90 6.34,18.41 6.34,18.67 | C51.1 v9.52,11.43 v9.52,10.79 arc-90 8.89,10.16 6.97,10.16 arc-90 6.34,10.79 6.34,11.05
  Top 1.016: R88.2 v88.67,23.49
  Bottom 0.152: 18.4,38.1 C78.1 | U22.4 90.42,28.07 arc-90 90.81,27.69 90.81,27.46 arc-45 90.69,27.19 90.28,26.78 arc-45 90.01,26.67 v89.53,26.67
  Bottom 0.203: C78.1 18.41,38.07 | 83.2,19.05 C81.1 83.19,19.05
  Bottom 0.406: CNW.1 18.4,38.1 | 18.41,38.07 v18.41,36.51 | CSE.1 83.2,19.05 | v83.19,20.95 83.19,19.05
  Bottom 0.813: v88.67,25.4 v88.67,24.45 v88.67,23.49 94.23,23.49 | 94.23,23.49 U26.3 | 94.23,23.49 94.23,22.17 C83.1
  pour Route2: 8.25,43.81 11.43,43.81 11.43,37.47 19.05,37.47 19.05,34.29 11.43,34.29 11.43,20.95 30.48,20.95 30.48,22.86 63.5,22.86 63.5,27.3 69.85,27.3 69.85,22.23 80.01,22.23 80.01,34.29 38.1,34.29 38.1,29.84 31.75,29.84 31.75,40 78.1,40 78.1,45.09 85.09,45.09 85.09,26.04 89.85,26.04 89.85,17.14 22.22,17.14 22.22,12.06 11.43,12.06 11.43,8.89 8.25,8.89
BETA_TDI  (via drill 0.25)
  Top 0.203: BETA.4 v69.6,47.12 | R116.2 v92.96,53.34
  Route2 0.203: v69.6,47.12 69.6,48.99 arc45 69.49,49.26 68.69,50.05 arc-45 68.58,50.32 68.58,54.96 arc-45 68.69,55.23 69.36,55.89 arc-45 69.63,56.01 91.41,56.01 arc-45 91.68,55.89 92.85,54.72 arc-45 92.96,54.45 v92.96,53.34
BETA_TDO  (via drill 0.25)
  Top 0.203: BETA.3 v69.6,54.61 | v90.49,51.62 R114.1
  Route2 0.203: v90.49,51.62 90.23,51.62 arc-90 89.85,52 89.85,54.07 arc45 89.74,54.34 89.07,55.01 arc45 88.81,55.12 70.27,55.12 arc45 70,55.01 v69.6,54.61
CD  (via drill 0.25)
  Top 0.203: SD1.CD1 v90.04,9.62
  Bottom 0.203: v90.04,9.62 U28.1
CD'  (via drill 0.25)
  Top 0.203: v88.27,20.32 87.26,20.32 arc-45 86.81,20.51 85.15,22.17 arc-45 84.96,22.61 84.96,31.91 arc-45 85.07,32.18 85.17,32.27 arc45 85.28,32.54 85.28,33.91 arc90 84.65,34.54 U9.22
  Bottom 0.203: U28.16 90.04,5.21 arc-90 89.79,4.95 arc-45 89.78,4.95 R99.2 88.52,4.95 arc-90 88.27,5.2 v88.27,20.32
CLK  (via drill 0.25)
  Top 0.203: SD1.5 v94.61,12.22
  Bottom 0.203: v94.61,12.22 93.1,12.22 arc45 92.83,12.11 92.16,11.44 arc45 92.05,11.17 U28.6
CMD  (via drill 0.25)
  Top 0.203: SD1.3 v94.61,14.42
  Bottom 0.203: v94.61,14.42 92.94,14.42 arc45 92.67,14.31 91.75,13.39 arc45 91.64,13.12 U28.5
CNW_EN  (via drill 0.25)
  Top 0.203: v15.88,29.84 15.76,29.96 U7.2
  Bottom 0.203: v15.88,29.84 16.14,29.84 arc90 16.52,30.23 CNW.3
CSE_EN  (via drill 0.25)
  Top 0.203: v84.45,22.23 84.45,32.23 arc-45 84.57,32.5 84.66,32.59 arc45 84.77,32.86 84.77,33.66 arc90 84.39,34.04 U9.21
  Bottom 0.203: CSE.3 85.08,21.34 arc45 84.89,21.79 v84.45,22.23
CSO_N_V'  (via drill 0.25 pad 0.25, 0.41 pad 0.25)
  Top 0.152: R69.1 9.29,55.88 v10.16,55.88
  Top 0.813: L12.2 v0.66,35.2 | v0.66,49.53 6.98,49.53 arc90 7.62,50.16 7.62,54.61 arc-90 8.25,55.25 R69.1
  Bottom 0.152: v10.16,55.88 10.16,55.63 arc90 10.41,55.37 11.99,55.37 arc-90 12.24,55.12 U14.1
  Bottom 0.813: v0.66,35.2 v0.66,49.53
CSO_NE_V  (via drill 0.25 pad 0.25)
  Top 0.152: v11.43,55.88 12.29,55.88 R69.2
  Top 0.457: 67.49,56.49 67.62,56.52 arc-90 68,56.13 BETA.7
  Top 0.813: R69.2 13.97,55.25 arc90 14.6,55.88 arc-90 15.21,56.49 67.49,56.49
  Bottom 0.152: U14.2 12.64,54.47 arc90 12.89,54.73 12.89,55.63 arc90 12.64,55.88 v11.43,55.88
CSO_NW_V  (via drill 0.36, 0.41)  (6 unrouted)
  Top 0.61: v18.41,44.77 18.41,45.72 arc-90 18.73,46.04 v20.95,46.04
  Bottom 0.305: CNW.5 18.41,41.81
  Bottom 0.508: 18.41,41.81 18.41,43.18 C77.1
  Bottom 0.559: v18.41,44.77 18.41,43.18 | v20.95,46.04 PWR-NW.6
CSO_S_V'  (via drill 0.25 pad 0.25)
  Top 0.152: R72.1 9.29,1.27 v10.16,1.27
  Top 0.813: L10.2 1.29,19.95 arc90 0.66,19.32 0.66,8.25 arc90 1.29,7.62 6.98,7.62 arc-90 7.62,6.98 7.62,2.54 arc90 8.25,1.9 R72.1
  Bottom 0.152: U15.1 8.95,2.18 arc90 8.7,1.92 8.7,1.52 arc90 8.95,1.27 v10.16,1.27
CSO_SE_V  (via drill 0.36, 0.41)  (6 unrouted)
  Top 0.61: v83.19,12.38 83.19,11.43 arc-90 82.87,11.11 v80.64,11.11
  Bottom 0.508: CSE.5 83.19,15.34 83.19,13.97 C80.1
  Bottom 0.559: v83.19,12.38 83.19,13.97 | v80.64,11.11 PWR-SE.6
CSO_SW_V  (via drill 0.25 pad 0.25)
  Top 0.152: R72.2 12.29,1.27 v11.43,1.27
  Top 0.457: 65.89,0.66 66.02,0.63 arc90 66.4,1.02 BETA.112
  Top 0.813: R72.2 13.97,1.9 arc-90 14.6,1.27 arc90 15.21,0.66 65.89,0.66
  Bottom 0.152: U15.2 8.76,2.68 arc90 8.38,2.29 8.38,1.14 arc90 8.76,0.76 11.18,0.76 arc90 11.43,1.02 v11.43,1.27
DAT0  (via drill 0.25)
  Top 0.203: SD1.7 v94.61,10.02
  Bottom 0.203: v94.61,10.02 93.22,10.02 arc45 92.95,9.91 92.54,9.5 arc45 92.43,9.23 U28.7
DAT1  (via drill 0.25)
  Top 0.203: SD1.8 v94.61,8.92
  Bottom 0.203: v94.61,8.92 93.38,8.92 arc45 93.11,8.81 92.95,8.65 arc45 92.84,8.38 U28.8
DAT2  (via drill 0.25)
  Top 0.203: SD1.1 v94.61,16.62
  Bottom 0.203: v94.61,16.62 92.64,16.62 arc45 92.37,16.51 90.94,15.08 arc45 90.83,14.81 U28.3
DAT3  (via drill 0.25)
  Top 0.203: SD1.2 v94.61,15.52
  Bottom 0.203: v94.61,15.52 92.79,15.52 arc45 92.52,15.41 91.35,14.23 arc45 91.24,13.96 U28.4
E_I2C_EN
  Top 0.152: U9.5 81.16,38.17 arc90 80.91,38.42 U12.3
E_I2C_V  (via drill 0.36)
  Top 0.356: U12.1 80.64,40.35 v80.64,41.59
  Bottom 0.356: PWR-NE.6 81.25,53.97 arc-90 81.64,53.59 81.64,42.85 arc-45 81.45,42.4 v80.64,41.59 C31.1
E_SPI_EN
  Top 0.152: U9.2 82.66,38.17 arc-90 82.92,38.42 U12.4
E_SPI_V  (via drill 0.36)
  Top 0.356: U12.6 83.19,40.35 v83.19,41.59
  Bottom 0.356: PWR-NE.8 82.57,53.97 arc90 82.19,53.59 82.19,42.85 arc45 82.38,42.4 v83.19,41.59 C32.1
E_VE  (via drill 0.25 pad 0.25, 0.36)
  Top 0.152: R81.2 v60.32,13.97
  Top 0.813: R81.2 60.32,12.51 arc90 60.71,12.13 74.04,12.13 v74.3,12.38
  Bottom 0.152: U19.2 55.11,12.45 arc90 55.49,12.06 59.94,12.06 arc90 60.32,12.45 v60.32,13.97
  Bottom 0.813: PWR-SE.4 78.1,11.75 arc90 77.47,12.38 v74.3,12.38
E_VE'  (via drill 0.25 pad 0.25)
  Top 0.152: R81.1 v60.32,15.24
  Top 0.508: L5.2 58.6,16.1 R81.1
  Bottom 0.152: U19.1 55.61,12.76 arc90 55.99,12.38 59.31,12.38 arc90 59.69,12.76 59.69,14.86 arc-90 60.07,15.24 v60.32,15.24
EE_CLK1
  Bottom 0.152: R4.1 100.08,43.23 U2.4 100.13,44.2 arc90 99.87,44.45 96.65,44.45 96.53,44.34 U1.44
EE_CS1
  Bottom 0.152: U1.45 96.56,43.84 arc45 96.74,43.91 96.83,43.99 arc-45 97.01,44.07 98.93,44.07 arc-90 99.19,43.81 U2.5 R3.1
EE_DATA1
  Bottom 0.152: R6.2 99.76,47.03 arc45 99.84,46.85 100.05,46.63 arc-45 100.13,46.45 U2.3 100.13,45.09 arc-90 99.87,44.83 96.27,44.83 96.26,44.84 U1.43
EE_EN  (via drill 0.25 pad 0.25, 0.33 pad 0.25)
  Top 0.203: EE.3 60.71,19.38 arc90 60.96,19.63 v60.96,20.32 | U6.7 52.75,24.88 arc45 52.86,24.61 53.35,24.11 arc45 53.62,24 60.17,24 arc-45 60.44,23.89 60.85,23.48 arc-45 60.96,23.21 v60.96,22.86
  Bottom 0.203: v60.96,20.32 61.21,20.32 arc90 61.59,20.7 61.59,22.48 arc90 61.21,22.86 v60.96,22.86
EE_PG
  Top 0.203: EE.5 56.45,20.02 arc-90 56.2,20.27 56.2,23.11 arc90 55.82,23.49 53.34,23.49 arc-45 53.08,23.61 52.16,24.52 arc-45 52.05,24.79 U6.6
FTDI_D_N  (via drill 0.25 pad 0.25)
  Top 0.152: USB.2 v92.71,43.8 92.57,43.94 U3.1
  Bottom 0.152: U1.6 91.31,43.04 arc-90 92.07,43.8 v92.71,43.8
FTDI_D_P  (via drill 0.25 pad 0.25)
  Top 0.152: USB.3 v92.71,44.45 U3.2
  Bottom 0.152: U1.7 90.81,43.18 arc-90 92.08,44.45 v92.71,44.45
FTDI_TCK  (via drill 0.25)
  Top 0.203: BETA.1 v70.4,51.44
  Route2 0.203: v70.4,51.44 70.4,53.56 arc-45 70.51,53.83 70.8,54.12 arc-45 71.07,54.23 86.65,54.23 arc-45 86.92,54.12 87.2,53.83 arc-45 87.31,53.56 87.31,45.6 arc45 87.42,45.34 88.15,44.61 arc-45 88.27,44.34 v88.27,42.34
  Bottom 0.203: U1.13 v88.27,42.34 | v70.4,51.44 ZED.1
FTDI_TDI  (via drill 0.25)
  Top 0.203: v87.76,42.84 87.76,50.03 arc-45 87.87,50.3 88.25,50.69 arc-45 88.52,50.8 91.69,50.8 arc90 92.07,51.18 R115.1 R116.1
  Bottom 0.203: v87.76,42.84 U1.14
FTDI_TDO  (via drill 0.25)
  Route2 0.203: v69.6,51.44 69.6,53.63 arc-45 69.71,53.9 70.38,54.56 arc-45 70.65,54.67 86.96,54.67 arc-45 87.23,54.56 87.64,54.15 arc-45 87.76,53.88 87.76,45.91 arc45 87.87,45.64 88.66,44.84 arc-45 88.77,44.57 v88.77,43.34
  Bottom 0.203: U1.15 v88.77,43.34 | v69.6,51.44 ZED.3
FTDI_TMS  (via drill 0.25)
  Top 0.203: BETA.2 v70.4,47.12
  Route2 0.203: v70.4,47.12 70.4,49.92 arc-45 70.51,50.19 70.82,50.5 arc45 70.93,50.77 70.93,53.25 arc-45 71.04,53.52 71.2,53.67 arc-45 71.47,53.78 86.33,53.78 arc-45 86.6,53.67 86.76,53.52 arc-45 86.87,53.25 86.87,46.91 arc-45 86.76,46.64 v85.85,45.74
  Bottom 0.203: v70.4,47.12 ZED.2 | U1.16 86.11,43.84 arc-90 85.85,44.09 v85.85,45.74
GND  (via drill 0.25, 0.25 pad 0.25, 0.3 pad 0.25, 0.33 pad 0.25, 0.38 pad 0.25, 0.41 pad 0.25, 0.61 pad 0.25, 3.17 pad 4.5)
  Top 0.152: USB.5 96.84,46.04 v97.15,46.35 arc45 v97.16,46.36
  Top 0.203: U3.3 92.58,44.96 v92.71,45.09 | C82.2 59.14,28.12 arc-90 59.4,27.87 U25.1 | C11.2 22.44,34.48 arc-90 22.69,34.22 U4.1 | 15.75,32.26 v15.88,32.38 15.88,32.26 U7.23 | 50.04,27.81 v50.16,27.94 50.16,27.81 U6.23 47.62,27.82 | C12.2 79.16,22.67 arc-90 78.91,22.93 U5.1 | U7.25 v17.14,33.66 | U6.25 v51.43,29.21 | 82.68,35.05 v82.55,34.92 | 82.55,35.05 v82.55,34.92 | U9.25 v81.28,33.66 | U9.23 82.66,35.04 v82.55,34.92 | 18.92,22.1 v19.05,22.23 | 19.05,22.1 v19.05,22.23 | U8.25 v20.32,23.49 | U8.23 18.93,22.11 v19.05,22.23
  Bottom 0.152: U2.2 99.19,46.36 arc90 98.93,46.61 97.57,46.61 arc45 97.3,46.5 v97.16,46.36
  Bottom 0.203: U27.6 70.63,29.52 arc45 70.9,29.63 71.33,30.05 arc45 71.44,30.32 v71.44,30.8 | U15.5 10.79,4.18 U15.EPAD | U14.5 10.79,52.97 U14.EPAD | U18.5 47.99,42.55 U18.EPAD | U20.5 67.04,42.55 v66.67,42.55 U20.EPAD | U17.5 34.56,14.6 U17.EPAD | U19.5 53.61,14.6 U19.EPAD | U21.5 71.75,19.64 | U22.5 88.27,27.57 U22.EPAD
  other vias: 34.4,6.35 36.8,6.35 42.4,6.35 44.8,6.35 50.4,6.35 52.8,6.35 55.2,6.35 57.6,6.35 60,6.35 62.4,6.35 64.8,6.35 64.8,50.8 62.4,50.8 60,50.8 57.6,50.8 55.2,50.8 52.8,50.8 50.4,50.8 44.8,50.8 42.4,50.8 36.8,50.8 32.8,50.8 40,50.8 40,6.35 42.74,38.99 43.62,38.99 42.74,38.1 43.62,38.1 42.74,37.21 43.62,37.21 52.26,38.99 53.15,38.99 52.26,38.1 53.15,38.1 52.26,37.21 53.15,37.21 61.79,38.99 62.67,38.99 61.79,38.1 62.67,38.1 61.79,37.21 62.67,37.21 71.31,38.99 72.2,38.99 71.31,38.1 72.2,38.1 71.31,37.21 72.2,37.21 58.86,18.16 57.98,18.16 58.86,19.05 57.98,19.05 58.86,19.94 57.98,19.94 49.34,18.16 48.45,18.16 49.34,19.05 48.45,19.05 49.34,19.94 48.45,19.94 39.81,18.16 38.93,18.16 39.81,19.05 38.93,19.05 39.81,19.94 38.93,19.94 30.29,18.16 29.4,18.16 30.29,19.05 29.4,19.05 30.29,19.94 29.4,19.94 6.1,12.89 6.1,13.78 6.98,12.89 6.98,13.78 7.87,12.89 7.87,13.78 6.1,20.51 6.1,21.4 6.98,20.51 6.98,21.4 7.87,20.51 7.87,21.4 6.1,28.13 6.1,29.02 6.98,28.13 6.98,29.02 7.87,28.13 7.87,29.02 6.1,35.75 6.1,36.64 6.98,35.75 6.98,36.64 7.87,35.75 7.87,36.64 6.1,43.37 6.1,44.26 6.98,43.37 6.98,44.26 7.87,43.37 7.87,44.26 10.48,22.23 10.48,21.59 4.13,19.05 4.76,19.05 42.86,43.81 43.5,43.81 43.81,34.61 44.45,34.61 10.48,14.6 10.48,13.97 4.13,11.43 4.76,11.43 10.48,29.84 10.48,29.21 4.13,26.67 4.76,26.67 10.48,37.47 10.48,36.83 4.13,34.29 4.76,34.29 10.48,45.09 10.48,44.45 4.13,41.91 4.76,41.91 30.16,13.33 29.53,13.33 29.21,22.54 28.57,22.54 39.69,13.33 39.05,13.33 38.73,22.54 38.1,22.54 49.21,13.33 48.58,13.33 48.26,22.54 47.62,22.54 58.74,13.33 58.1,13.33 57.78,22.54 57.15,22.54 71.44,43.81 72.07,43.81 72.39,34.61 73.03,34.61 61.91,43.81 62.55,43.81 62.86,34.61 63.5,34.61 52.39,43.81 53.02,43.81 53.34,34.61 53.97,34.61 15.88,33.66 17.14,32.38 50.16,29.21 51.43,27.94 68.83,24.57 68.83,23.69 67.94,24.57 67.94,23.69 67.06,24.57 67.06,23.69 68.83,16.95 68.83,16.07 67.94,16.95 67.94,16.07 67.06,16.95 67.06,16.07 32.77,32.58 32.77,33.46 33.66,32.58 33.66,33.46 34.54,32.58 34.54,33.46 32.77,40.2 32.77,41.08 33.66,40.2 33.66,41.08 34.54,40.2 34.54,41.08 64.45,15.24 64.45,15.88 73.34,16.83 73.34,16.19 64.45,22.86 64.45,23.49 73.34,24.45 73.34,23.81 37.15,34.29 37.15,33.66 28.26,32.7 28.26,33.34 37.15,41.91 37.15,41.27 28.26,40.32 28.26,40.96 13.97,35.56 48.26,31.11 10.79,53.97 13.97,47.62 10.79,3.18 88.27,28.57 0.63,22.23 19.05,29.84 25.4,30.48 43.18,30.48 40,30.48 45.72,28.57 56.2,25.08 45.08,11.43 56.52,45.72 73.03,8.25 73.03,4.45 28.57,8.25 28.57,4.45 34.4,10.16 34.4,2.54 36.8,10.16 36.8,2.54 40,10.16 42.4,10.16 42.4,2.54 44.8,10.16 44.8,2.54 50.4,10.16 50.4,2.54 52.8,2.54 52.8,10.16 57.6,2.54 57.6,10.16 60,2.54 60,10.16 62.4,10.16 62.4,2.54 32.8,54.61 32.8,46.99 36.8,46.99 36.8,54.61 40,54.61 42.4,54.61 42.4,46.99 44.8,46.99 44.8,54.61 50.4,54.61 50.4,46.99 52.8,46.99 52.8,54.61 57.6,54.61 57.6,46.99 60,46.99 60,54.61 62.4,54.61 62.4,46.99 64.8,54.61 64.8,46.99 28.57,48.89 28.57,52.7 73.03,52.7 73.03,48.89 65.41,42.55 46.35,42.55 47.62,42.55 34.92,14.6 36.19,14.6 53.97,14.6 55.24,14.6 13.97,9.52 81.91,23.49 85.72,23.49 81.91,26.67 85.72,26.67 85.72,20.32 91.44,20.32 91.44,24.77 91.44,32.38 86.36,36.83 99.69,36.83 29.84,37.15 29.84,35.88 71.75,21.27 71.75,20 58.1,25.08 55.56,30.8 13.97,40.64 21.59,38.1 80.01,19.05 76.83,50.8 76.83,6.35 24.76,6.35 24.76,50.8 17.14,50.8 84.45,6.35 89.53,15.56 89.53,12.7 15.24,26.04 15.24,28.57 86.36,32.38 45.72,26.67 43.18,26.67 25.4,25.4 86.36,41.27 89.53,46.99 49.21,40.64 49.21,39.37 58.74,39.37 58.74,40.64 68.26,40.64 68.26,39.37 52.39,17.78 52.39,16.51 42.86,17.78 33.34,17.78 33.34,16.51 42.86,16.51 5.71,25.08 5.71,32.7 5.71,40.32 5.71,17.46 79.38,50.8 22.22,6.35 3.81,53.34 3.81,55.32 5.21,54.74 5.79,53.34 5.21,51.94 3.81,51.36 2.41,51.94 1.83,53.34 2.41,54.74 97.79,53.34 97.79,55.32 99.19,54.74 99.77,53.34 99.19,51.94 97.79,51.36 96.39,51.94 95.81,53.34 96.39,54.74 3.81,3.81 3.81,5.79 5.21,5.21 5.79,3.81 5.21,2.41 3.81,1.83 2.41,2.41 1.83,3.81 2.41,5.21 97.79,3.81 97.79,5.79 99.19,5.21 99.77,3.81 99.19,2.41 97.79,1.83 96.39,2.41 95.81,3.81 96.39,5.21 82.55,33.66 81.28,34.92 19.05,23.49 20.32,22.23 78.74,31.11
  pour Top (rank 3): 101.6,0 0,0 0,57.15 101.6,57.15
  pour Bottom (rank 3): 101.6,0 0,0 0,57.15 101.6,57.15
  pour Route15: 27.3,55.25 27.3,46.36 74.3,46.36 74.3,55.25
  pour Route15: 27.3,10.79 27.3,1.9 74.3,1.9 74.3,10.79
  pour Route2 (rank 3): 101.6,0 0,0 0,57.15 101.6,57.15
  cutout Top: 52,2.15 53.2,2.15 53.2,1.12 52,1.12
  cutout Top: 53.2,55 52,55 52,56.03 53.2,56.03
  cutout Top: 83.19,33.02 80.64,33.02 80.64,35.56 83.19,35.56
  cutout Top: 49.53,29.84 52.07,29.84 52.07,27.3 49.53,27.3
  cutout Top: 18.41,24.13 20.95,24.13 20.95,21.59 18.41,21.59
IOE_EN  (via drill 0.25 pad 0.25)
  Top 0.203: IOE.3 67.61,18.67 arc90 67.23,19.05 v66.67,19.05 | v64.13,19.05 63.66,19.05 arc-45 63.39,19.16 63.1,19.45 arc-45 62.99,19.72 62.99,28.42 arc-45 63.1,28.69 63.9,29.48 arc-45 64.17,29.59 80.76,29.59 arc45 81.21,29.78 81.98,30.54 arc45 82.16,30.99 U9.16
  Bottom 0.203: v66.67,19.05 66.67,19.3 arc90 66.29,19.68 64.52,19.68 arc90 64.13,19.3 v64.13,19.05
IOE_PG
  Top 0.203: IOE.5 66.98,14.67 arc-90 66.73,14.41 63.91,14.41 arc-45 63.64,14.53 62.6,15.57 arc-45 62.48,15.84 62.48,28.67 arc-45 62.6,28.94 63.64,29.99 arc-45 63.91,30.1 80.51,30.1 arc45 80.96,30.29 81.48,30.81 arc45 81.66,31.25 U9.15
IOE_V  (via drill 0.25, 0.25 pad 0.25, 0.3 pad 0.25)
  Top 0.152: v73.03,18.41 R67.2
  Top 0.813: v74.3,13.65 74.3,17.02 73.89,17.42 R67.2
  Route15 0.406: v76.38,22.04 74.48,20.14 arc45 74.3,19.69 v74.3,13.65
  Bottom 0.152: U21.4 73.91,20.14 arc-90 74.3,19.76 74.3,18.8 arc-90 73.91,18.41 v73.03,18.41
  Bottom 0.305: R12.1 R9.1 R10.1 v76.38,22.04
  Bottom 0.813: PWR-SE.5 79.76,3.18 arc-90 79.38,3.56 79.38,13.02 arc90 78.74,13.65 v74.3,13.65
IOE_V'  (via drill 0.25 pad 0.25)
  Top 0.152: R67.1 v71.75,18.41
  Top 0.508: L15.2 70.89,16.55 R67.1
  Bottom 0.152: U21.3 74.23,20.64 arc-90 74.61,20.26 74.61,18.16 arc-90 74.23,17.78 72.14,17.78 arc-90 71.75,18.16 v71.75,18.41
IOW_EN  (via drill 0.25 pad 0.25)
  Top 0.203: IOW.3 33.98,38.48 arc90 34.37,38.1 v34.92,38.1 | v37.46,38.1 37.94,38.1 arc-45 38.21,37.99 38.5,37.7 arc-45 38.61,37.43 38.61,28.35 arc-45 38.5,28.08 38.08,27.67 arc-45 37.81,27.56 20.84,27.56 arc45 20.39,27.37 19.62,26.61 arc45 19.43,26.16 U8.16
  Bottom 0.203: v34.92,38.1 34.92,37.85 arc90 35.31,37.47 37.08,37.47 arc90 37.46,37.85 v37.46,38.1
IOW_PG